# EAGLE design laser-access (EAGLE 7.2.0)
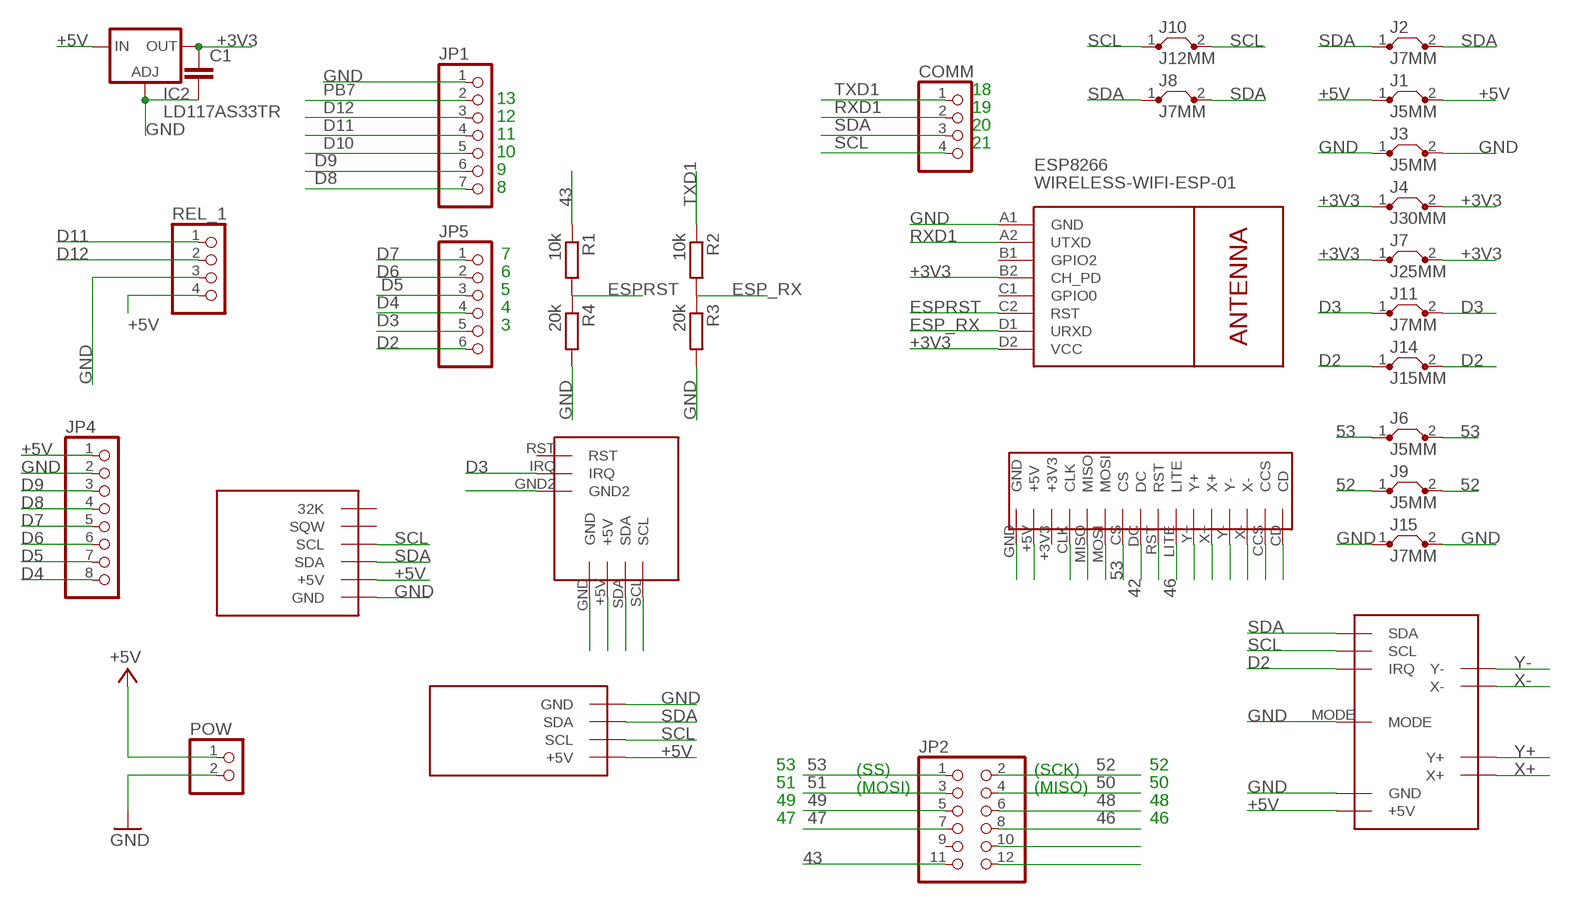
[diagram p0: schematic, sheet 1]

## Parts
C1  C-EU050-024X044  [C050-024X044]
COMM  PINHD-1X4  [1X04]
ESP8266  WIRELESS-WIFI-ESP-01  [WIRELESS-WIFI-ESP-01]
I2C-EEPROM  I2C-EEPROM  [I2C-EEPROM]
IC2  LD117AS33TR  [SOT223]
J1  J5MM  [05]
J2  J7MM  [07]
J3  J5MM  [05]
J4  J30MM  [30]
J6  J5MM  [05]
J7  J25MM  [25]
J8  J7MM  [07]
J9  J5MM  [05]
J10  J12MM  [12]
J11  J7MM  [07]
J14  J15MM  [15]
J15  J7MM  [07]
JP1  PINHD-1X7  [1X07]
JP2  PINHD-2X6  [2X06]
JP4  PINHD-1X8/90  [1X08/90]
JP5  PINHD-1X6  [1X06]
POW  PINHD-1X2  [1X02]
R1  10k  R-EU_0207/10  [0207/10]
R2  10k  R-EU_0207/10  [0207/10]
R3  20k  R-EU_0207/10  [0207/10]
R4  20k  R-EU_0207/10  [0207/10]
REL_1  PINHD-1X4  [1X04]
U$1  I2C-RTC  [I2C-RTC]
U$3  TFT-2.4-SPI  [TFT-SPI-2.4]
U$4  I2C-NFC-V3  [I2C-NFC-V3]
U$6  R-TOUCH  [R-TOUCH]

## Nets
42: JP2.12 U$3.DC
43: JP2.11 R1.1
44: JP2.10 U$3.RST
46: JP2.8 U$3.LITE
47: JP2.7
48: JP2.6 U$3.CCS
49: JP2.5
50: JP2.4 U$3.MISO
51: JP2.3 U$3.MOSI
52: J9.1 J9.2 JP2.2 U$3.CLK
53: J6.1 J6.2 JP2.1 U$3.CS
+3V3: C1.1 ESP8266.B2(CH_PD) ESP8266.D2(VCC) IC2.4(OUT) J4.1 J4.2 J7.1 J7.2
+5V: I2C-EEPROM.+5V IC2.3(IN) J1.1 J1.2 JP4.1 POW.1 REL_1.4 U$1.+5V U$3.+5V U$4.+5V U$6.+5V
D2: J14.1 J14.2 JP5.6 U$6.IRQ
D3: J11.1 J11.2 JP5.5 U$4.IRQ
D4: JP4.8 JP5.4
D5: JP4.7 JP5.3
D6: JP4.6 JP5.2
D7: JP4.5 JP5.1
D8: JP1.7 JP4.4
D9: JP1.6 JP4.3
D10: JP1.5
D11: JP1.4 REL_1.1
D12: JP1.3 REL_1.2
ESP_RX: ESP8266.D1(URXD) R2.2 R3.1
ESPRST: ESP8266.C2(RST) R1.2 R4.1
GND: C1.2 ESP8266.A1(GND) I2C-EEPROM.GND IC2.1(ADJ) J3.1 J3.2 J15.1 J15.2 JP1.1 JP4.2 POW.2 R3.2 R4.2 REL_1.3 U$1.GND U$3.GND U$4.GND U$4.GND2 U$6.GND U$6.MODE
N$19: U$3.CD
PB7: JP1.2
RXD1: COMM.2 ESP8266.A2(UTXD)
SCL: COMM.4 I2C-EEPROM.SCL J10.1 J10.2 U$1.SCL U$4.SCL U$6.SCL
SDA: COMM.3 I2C-EEPROM.SDA J2.1 J2.2 J8.1 J8.2 U$1.SDA U$4.SDA U$6.SDA
TXD1: COMM.1 R2.1
X+: U$3.X+ U$6.X+
X-: U$3.X- U$6.X-
Y+: U$3.Y+ U$6.Y+
Y-: U$3.Y- U$6.Y-
Unconnected: ESP8266.B1(GPIO2) ESP8266.C1(GPIO0) JP2.9 U$1.32K U$1.SQW U$3.+3V3 U$4.RST

## Notes on the sheet
- 18
- 13
- 19
- 12
- 20
- 11
- 21
- 10
- 9
- 8
- 7
- 6
- 5
- 4
- 3
- 53 | (SS) | (SCK) | 52
- 51 | (MOSI) | (MISO) | 50
- 49 | 48
- 47 | 46

## Library data of the parts
C1 = resistor:C-EU: CAPACITOR, European symbol
COMM REL_1 = pinhead:PINHD-1X4: PIN HEADER
ESP8266 = diy-modules:WIRELESS-WIFI-ESP-01: Wireless Wi-Fi ESP-01 Module based on ESP8266 chip
I2C-EEPROM = alex:I2C-EEPROM: I2C-EEPROM
IC2 = v-reg:LD117A?*: Low drop fixed and adjustable positive voltage regulators 1 A Source: http://www.st.com/stonline/products/literature/ds/7194/ld1117axx.pdf
J1-J4 J6-J11 J14 J15 = jumper:J: Bridge
JP1 = pinhead:PINHD-1X7: PIN HEADER
JP2 = pinhead:PINHD-2X6: PIN HEADER
JP4 = pinhead:PINHD-1X8: PIN HEADER
JP5 = pinhead:PINHD-1X6: PIN HEADER
POW = pinhead:PINHD-1X2: PIN HEADER
R1-R4 = resistor:R-EU_: RESISTOR, European symbol
U$1 = alex:I2C-RTC: I2C-RTC
U$3 = alex:TFT-2.4-SPI: TFT Display 2.4" SPI
U$4 = alex:I2C-NFC-V3: NFC I2C module v3
U$6 = alex:R-TOUCH: Resistive touch XY-> I2C+IRQ converter

## Net classes
0 default: width 0.15 mm, drill 0.3 mm, clearance 0.15 mm

## Board
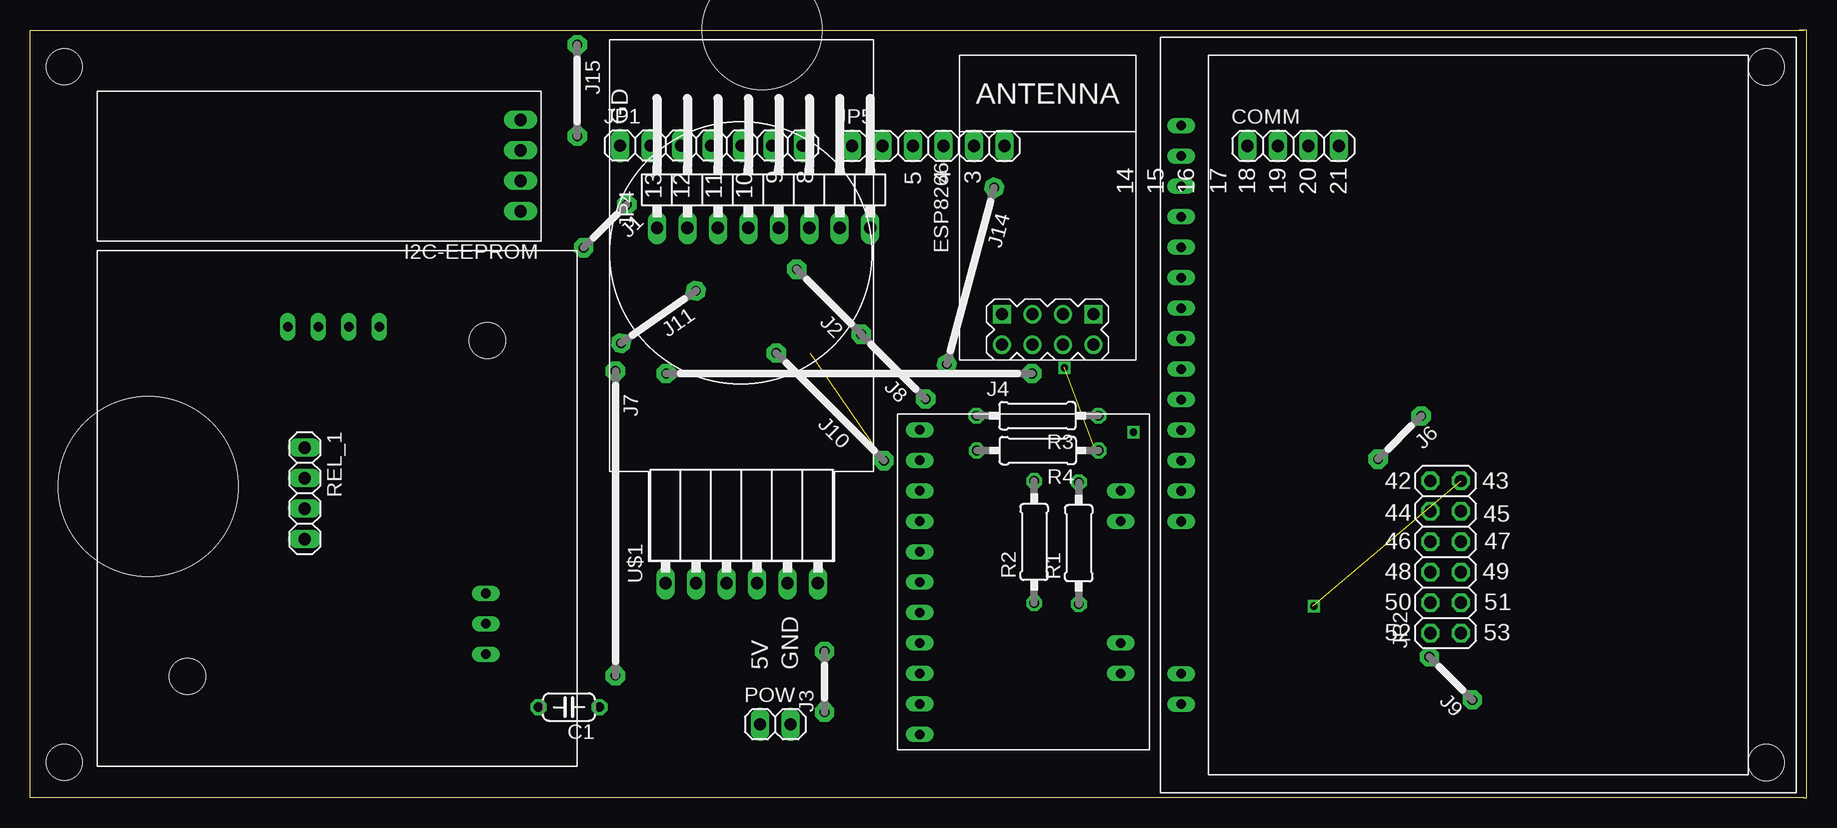
[diagram p1: board, top side]
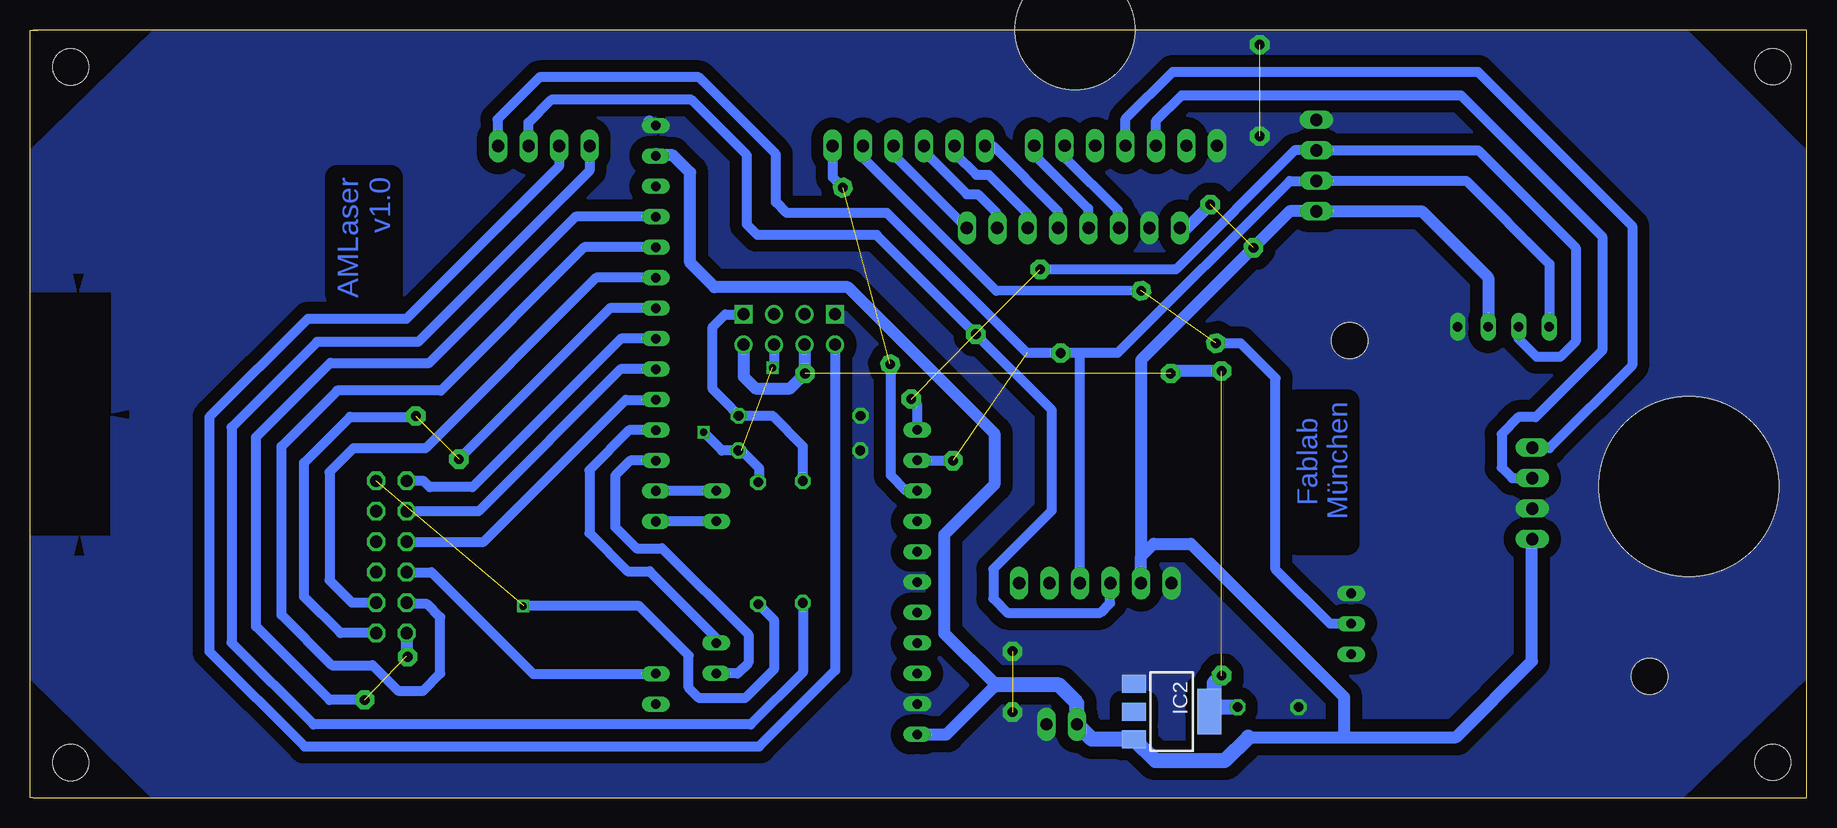
[diagram p2: board, bottom side, seen from below]

Size 148.12 x 64.04 mm. Coordinates in mm from the lower left corner, seen from the top.
Outline: 147.84,64.03 117.92,64.04 0,64.02 0,0 147.85,0
Outline: 147.87,0 148.12,0 148.12,64.02 147.47,64.02
Copper layers (1*16): Top 0.035mm / dielectric 1.5mm / Bottom 0.035mm
Design rules "default *": minimum track width 40mil, minimum drill 1mm, track to track 40mil, track to pad 40mil, pad to pad 8mil, via to via 8mil, smd to smd 8mil, copper to edge 1mil, drill to drill 8mil, minimum pad ring 10mil, minimum via ring 8mil, stop-mask expansion 4mil, vias tented up to drill 0mil, thermal gap 0mil
Holes 3 mm at 2.85,60.98 2.85,2.98
Holes 10 mm at 61.02,64.07
Holes 15 mm at 9.85,25.98
bRestrict: area 141.4,21.9 to 148.1,42.1; 9 lines

### Footprints (pad centres in the part's own frame; a part is rotated, then mirrored left to right if it is on the bottom)
C050-024X044 = drill 0.813 octagon: 1 -2.54,0; 2 2.54,0
1X04 = drill 1.016 long: 1 -3.81,0; 2 -1.27,0; 3 1.27,0; 4 3.81,0
WIRELESS-WIFI-ESP-01 = drill 1 square: A1 -8.89,3.81; D1 -8.89,-3.81 | drill 1: A2 -11.43,3.81; B1 -8.89,1.27; B2 -11.43,1.27; C1 -8.89,-1.27; C2 -11.43,-1.27; D2 -11.43,-3.81
I2C-EEPROM = drill 1.016 long: +5V 35.276,2.474; GND 35.276,10.094; SCL 35.276,5.014; SDA 35.276,7.554
SOT223 = smd 1.5 x 2: 1 -2.3,-3.15; 2 0,-3.15; 3 2.3,-3.15 | smd 3.8 x 2: 4 0,3.15
05 = drill 0.813 pad 1.6 octagon: 1 -2.54,0; 2 2.54,0
07 = drill 0.813 pad 1.6 octagon: 1 -3.81,0; 2 3.81,0
30 = drill 0.813 pad 1.6 octagon: 1 -15.24,0; 2 15.24,0
25 = drill 0.813 pad 1.6 octagon: 1 -12.7,0; 2 12.7,0
12 = drill 0.813 pad 1.6 octagon: 1 -6.35,0; 2 6.35,0
15 = drill 0.813 pad 1.6 octagon: 1 -7.62,0; 2 7.62,0
1X07 = drill 1.016 long: 1 -7.62,0; 2 -5.08,0; 3 -2.54,0; 4 0,0; 5 2.54,0; 6 5.08,0; 7 7.62,0
2X06 = drill 1.016 octagon: 1 -6.35,-1.27; 2 -6.35,1.27; 3 -3.81,-1.27; 4 -3.81,1.27; 5 -1.27,-1.27; 6 -1.27,1.27; 7 1.27,-1.27; 8 1.27,1.27; 9 3.81,-1.27; 10 3.81,1.27; 11 6.35,-1.27; 12 6.35,1.27
1X08/90 = drill 1.016 long: 1 -8.89,-3.81; 2 -6.35,-3.81; 3 -3.81,-3.81; 4 -1.27,-3.81; 5 1.27,-3.81; 6 3.81,-3.81; 7 6.35,-3.81; 8 8.89,-3.81
1X06 = drill 1.016 long: 1 -6.35,0; 2 -3.81,0; 3 -1.27,0; 4 1.27,0; 5 3.81,0; 6 6.35,0
1X02 = drill 1.016 long: 1 -1.27,0; 2 1.27,0
0207/10 = drill 0.813 octagon: 1 -5.08,0; 2 5.08,0
I2C-RTC = drill 1.016 long: 32K 27.276,6.174; +5V 27.276,-3.986; GND 27.276,-6.526; SCL 27.276,1.094; SDA 27.276,-1.446; SQW 27.276,3.634
TFT-SPI-2.4 = drill 0.8 long: +3V3 -19.05,-24.765; +5V -21.59,-24.765; CCS 21.59,-24.765; CD 24.13,-24.765; CLK -16.51,-24.765; CS -8.89,-24.765; DC -6.35,-24.765; GND -24.13,-24.765; LITE -1.27,-24.765; MISO -13.97,-24.765; MOSI -11.43,-24.765; RST -3.81,-24.765; X+ 3.81,-24.765; X- 8.89,-24.765; Y+ 1.27,-24.765; Y- 6.35,-24.765 | hole 3: 29,24; -29,24
I2C-NFC-V3 = drill 0.8 long: +5V -15.74,1.405; GND -15.74,3.945; GND2 6.485,12.835; IRQ 9.025,12.835; RST 11.565,12.835; SCL -15.74,-3.675; SDA -15.74,-1.135 | hole 3: 13.41,-12.05; -14.59,12.95
R-TOUCH = drill 0.8 long: +5V 12.7,-8.62; GND 10.16,-8.62; IRQ -7.62,-8.62; MODE 0,-8.62; P$1 -5.08,-8.62; P$2 -2.54,-8.62; P$3 2.54,-8.62; P$4 5.08,-8.62; P$5 7.62,-8.62; SCL -10.16,-8.62; SDA -12.7,-8.62; X+ 7.62,8.12; X- -5.08,8.12; Y+ 5.08,8.12; Y- -7.62,8.12

### Placement (x,y rotation side)
C1  44.92,7.57 180 top
COMM  105.3,54.38 0 top
ESP8266  84.82,49.23 90 top
I2C-EEPROM  5.62,46.45 0 top
IC2  52.95,7.2 270 bottom
J1  47.95,47.67 225 top
J2  66.61,41.39 135 top
J3  66.22,9.7 90 top
J4  68.27,35.4 180 top
J6  114.17,30.05 225 top
J7  48.8,22.9 270 top
J8  71.97,35.97 135 top
J9  118.43,9.97 135 top
J10  66.7,32.62 135 top
J11  52.39,40.11 215 top
J14  78.39,43.54 255 top
J15  45.62,59 270 top
JP1  56.8,54.4 0 top
JP2  118,20.1 90 top
JP4  61.15,51.35 0 top
JP5  74.87,54.38 0 top
POW  62.12,6.15 0 top
R1  87.42,21.25 90 top
R2  83.7,21.35 90 top
R3  83.97,31.88 180 top
R4  84,28.98 180 top
REL_1  22.9,25.4 270 top
U$1  59.5,45.2 270 top
U$3  120.72,31.95 270 top
U$4  25.17,23.55 270 top
U$6  82.8,18 270 top

### Tracks (layer width: path | path; a pad name or v marks a point on that pad's centre or on a via)
42
  Bottom 0.813: U$3.DC 98.87,38.3 111.25,25.93 114.8,25.93 115.3,26.43 116.7,26.43 JP2.12
43  (1 unrouted)
  Bottom 0.813: R1.1 86.12,14.87 86.12,10.72 88.52,8.32 92.35,8.32 93.22,9.2 93.22,11.88 97.35,16 106.92,16
44
  Bottom 0.813: U$3.RST 98.89,35.76 110.75,23.9 JP2.10
46
  Bottom 0.813: JP2.8 110.3,21.37 98.47,33.2 95.98,33.2 U$3.LITE
48
  Bottom 0.813: JP2.6 114.65,18.83 106.17,10.35 95.97,10.35 U$3.CCS
50
  Bottom 0.813: U$3.MISO 101.93,45.92 113.87,33.98 122.52,33.98 122.52,33.95 127.15,29.33 127.15,15.25 122.97,11.07 119.57,11.07 117.45,8.95 115.35,8.95 113.92,10.38 113.92,15.07 115.02,16.18 116.61,16.18 JP2.4
51
  Bottom 0.813: U$3.MOSI 100.92,43.38 115.15,29.15 121.17,29.15 123.15,27.18 123.15,18.15 121.29,16.29 JP2.3
52  (1 unrouted)
  Bottom 0.813: U$3.CLK 102.66,48.46 114.85,36.27 123.1,36.27 129.27,30.1 129.27,14.3 123.15,8.18 J9.1
  Bottom 1.016: JP2.2 116.73,11.86 J9.2
53  (1 unrouted)
  Bottom 0.813: U$3.CS 99.78,40.84 J6.2 | JP2.1 122.25,13.75 125.27,16.78 125.27,27.95 121.45,31.78 116.03,31.78 J6.1
  Bottom 1.016: J6.1 116.06,31.75
+3V3  (2 unrouted)
  Bottom 1.016: J7.1 52.83,35.6 J4.2 | ESP8266.B2 83.55,35.44 J4.1 84.76,34.15 87.65,34.15 88.63,35.13 ESP8266.D2
  Bottom 1.27: C1.1 49.42,7.57 | 49.42,7.57 IC2.4 | J7.2 49.42,9.57 49.42,7.57
+5V  (1 unrouted)
  Bottom 1.016: 95.9,53.6 94.55,53.6 93.1,52.15 93.1,44.62 91.07,42.6 79.95,42.6 67.75,30.4 67.75,26.12 71.92,21.95 71.92,13.72 67.62,9.42 71.75,5.3 U$6.+5V | J1.1 51.67,47.54 JP4.1 | 46.57,5.07 38.77,5.07 | 38.77,5.07 29.25,5.07 22.92,11.4 22.92,21.57 REL_1.4 | U$4.+5V 26.57,43.38 32.12,48.92 I2C-EEPROM.+5V 43.1,48.92 J1.2 55.51,36.52 55.51,20.16 | U$1.+5V 55.51,20.16 | 38.77,5.07 38.6,5.25 38.6,8.42 51.37,21.2 54.47,21.2 55.51,20.16
  Bottom 1.27: 67.62,9.42 62.35,9.42 60.85,7.93 POW.1 59.6,4.9 IC2.3 54.32,3.12 48.52,3.12 46.57,5.07 | 95.9,53.6 U$3.+5V | U$4.+5V
D2  (1 unrouted)
  Bottom 0.813: U$6.IRQ 75.09,25.62 76.37,26.9 76.37,36.13 J14.2 | JP5.6 81.22,51.75 J14.1
D3  (1 unrouted)
  Bottom 0.813: JP5.5 78.68,53.38 67.58,42.27 J11.1 | U$4.IRQ 39.75,14.53 44.3,19.08 44.3,35 47.23,37.93 J11.2
D4
  Bottom 0.813: JP5.4 76.14,53.65 JP4.8
D5
  Bottom 0.813: JP5.3 73.6,53.93 70.02,50.35 69.12,50.35 67.57,48.8 67.57,47.62 JP4.7
D6
  Bottom 0.813: JP5.2 71.06,53.79 69.25,51.98 68.22,51.98 65.02,48.77 65.02,47.61 JP4.6
D7
  Bottom 0.813: JP5.1 67.87,54.38 62.45,48.95 62.45,47.57 JP4.5
D8
  Bottom 0.813: JP1.7 64.42,53.65 59.92,49.15 59.92,47.59 JP4.4
D9
  Bottom 0.813: JP1.6 61.88,53.45 57.47,49.05 57.47,47.68 JP4.3
D11
  Bottom 0.813: JP1.4 56.8,56.62 52.87,60.55 27.42,60.55 14.57,47.7 14.57,36.08 21.47,29.18 22.86,29.18 REL_1.1
D12
  Bottom 0.813: JP1.3 54.26,56.47 52.12,58.6 28.85,58.6 17.07,46.83 17.07,37.3 22.62,31.75 24.05,31.75 25.45,30.35 25.45,27.55 24.57,26.68 REL_1.2
ESP_RX
  Bottom 0.813: ESP8266.D1 88.64,40.33 90.17,40.33 91.22,39.27 91.22,34.1 90.15,33.02 R3.1 86.25,31.88 83.72,29.35 83.72,26.45 R2.2
ESPRST  (via drill 0.6)  (1 unrouted)
  Bottom 0.813: R1.2 87.37,26.38 87.37,27.53 88.82,28.98 R4.1 90.45,28.98 v91.97,30.5 92.07,30.6 | ESP8266.C2 86.09,36.01 v86.22,35.88
GND  (2 unrouted)
  Bottom 1.016: 96.27,56.05 U$3.GND | U$3.GND 96.49,56.41 96.49,56.01 | U$3.GND 96.02,56.05 96.03,56.01 | U$1.GND 52.77,18.05 52.85,18.05
  pour Bottom: 148.1,53.93 148.12,10 137.9,0.01 10.45,0 0,10.06 0,53.85 10.12,64.07 137.77,64.02
N$1  (via drill 0.6)
  other vias: 107.02,16
RXD1
  Bottom 0.813: ESP8266.A2 81.01,10.63 87.35,4.3 125.25,4.3 133.17,12.22 133.17,31.75 124.97,39.95 116.76,39.95 104.03,52.68 COMM.2
SCL  (1 unrouted)
  Bottom 0.813: 40.89,51.45 I2C-EEPROM.SCL | U$1.SCL 60.59,37.02 60.5,37.11 | I2C-EEPROM.SCL 40.91,51.45 43.12,51.45 57.47,37.11 60.5,37.11 | I2C-EEPROM.SCL 28.41,51.46 21.47,44.52 21.47,39.32 U$4.SCL | U$6.SCL 74.15,28.13 J10.1 | 60.5,37.11 J10.2 65.03,37.11 76.7,48.77 85.05,48.77 85.95,49.68 85.95,53.68 92.37,60.1 105.65,60.1 109.15,56.6 109.15,54.41 COMM.4
SDA  (3 unrouted)
  Bottom 0.813: COMM.3 106.57,56.33 104.67,58.23 93,58.23 88.37,53.6 88.37,47.83 87.5,46.95 77.56,46.95 J8.2 69.27,38.67 62.95,32.35 62.95,23.98 67.82,19.1 67.82,16.62 66.65,15.45 58.9,15.45 58.1,16.25 58.1,17.88 U$1.SDA | J2.2 52.62,44.08 42.7,54 I2C-EEPROM.SDA 27.4,54 19.27,45.88 19.27,38.08 20.57,36.77 22.52,36.77 24.04,38.29 U$4.SDA | J2.2 | J2.2 63.97,44.02 | J8.1 74.18,32.79 U$6.SDA
TXD1
  Bottom 0.813: COMM.1 101.49,52.31 115.77,38.02 124.2,38.02 131.32,30.9 131.32,12.95 124.5,6.12 88.05,6.12 83.7,10.47 R2.1
X+
  Bottom 0.813: U$3.X+ 98.08,28.14 99.35,26.88 99.35,22.6 97.57,20.83 95.45,20.83 88.25,13.62 88.25,11.28 89.15,10.38 U$6.X+
X-
  Bottom 0.813: U$6.X- 95.96,23.08 U$3.X-
Y+
  Bottom 0.813: U$3.Y+ 98.17,30.68 101.5,27.35 101.5,22.1 98.3,18.9 96.47,18.9 90.92,13.34 U$6.Y+
Y-
  Bottom 0.813: U$6.Y- 95.96,25.62 U$3.Y-

### Text on the board
Bottom: AMLaser / v1.0 | Fablab / München
tPlace: GD | 9 | 8 | 5 | 4 | 3 | 13 | 12 | 11 | 10 | 14 | 15 | 16 | 17 | 18 | 19 | 20 | 21 | 42 | 43 | 44 | 45 | 46 | 47 | 48 | 49 | 50 | 51 | 52 | 53 | 5V | GND